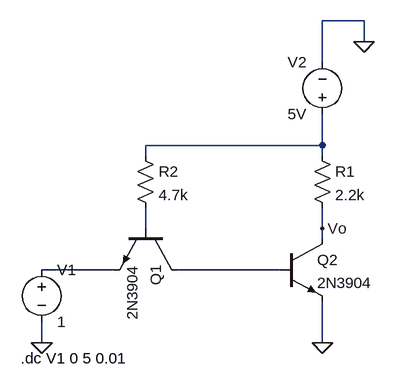
[diagram p0: schematic ttl inverter.asc]
ttl inverter.asc, the LTspice schematic file:
Version 4
SHEET 1 880 680
WIRE 496 -208 432 -208
WIRE 496 -176 496 -208
WIRE 432 -144 432 -208
WIRE 432 -16 432 -64
WIRE 432 -16 160 -16
WIRE 160 0 160 -16
WIRE 432 0 432 -16
WIRE 160 112 160 80
WIRE 432 112 432 80
WIRE 432 128 432 112
WIRE 112 176 0 176
WIRE 368 176 208 176
WIRE 0 288 0 256
WIRE 432 288 432 224
FLAG 0 288 0
FLAG 432 288 0
FLAG 496 -176 0
FLAG 432 112 Vo
SYMBOL npn 208 112 R90
SYMATTR InstName Q1
SYMATTR Value 2N3904
SYMBOL npn 368 128 R0
SYMATTR InstName Q2
SYMATTR Value 2N3904
SYMBOL res 416 -16 R0
SYMATTR InstName R1
SYMATTR Value 2.2k
SYMBOL res 144 -16 R0
SYMATTR InstName R2
SYMATTR Value 4.7k
SYMBOL voltage 0 160 R0
WINDOW 123 0 0 Left 0
WINDOW 39 0 0 Left 0
SYMATTR InstName V1
SYMATTR Value 1
SYMBOL voltage 432 -48 R180
WINDOW 0 24 96 Left 2
WINDOW 3 24 16 Left 2
WINDOW 123 0 0 Left 0
WINDOW 39 0 0 Left 0
SYMATTR InstName V2
SYMATTR Value 5V
TEXT -32 312 Left 2 !.dc V1 0 5 0.01

The netlist it stands for:
* ttl inverter.asc
Q1 N004 N002 N003 0 2N3904
Q2 Vo N004 0 0 2N3904
R1 N001 Vo 2.2k
R2 N001 N002 4.7k
V1 N003 0 1
V2 N001 0 5V
.model NPN NPN
.model PNP PNP
.lib standard.bjt
.dc V1 0 5 0.01
.backanno
.end